# EAGLE schematic AnalogConversion_v3 (EAGLE 9.6.2)

## Sheet 1 of 6: MAIN
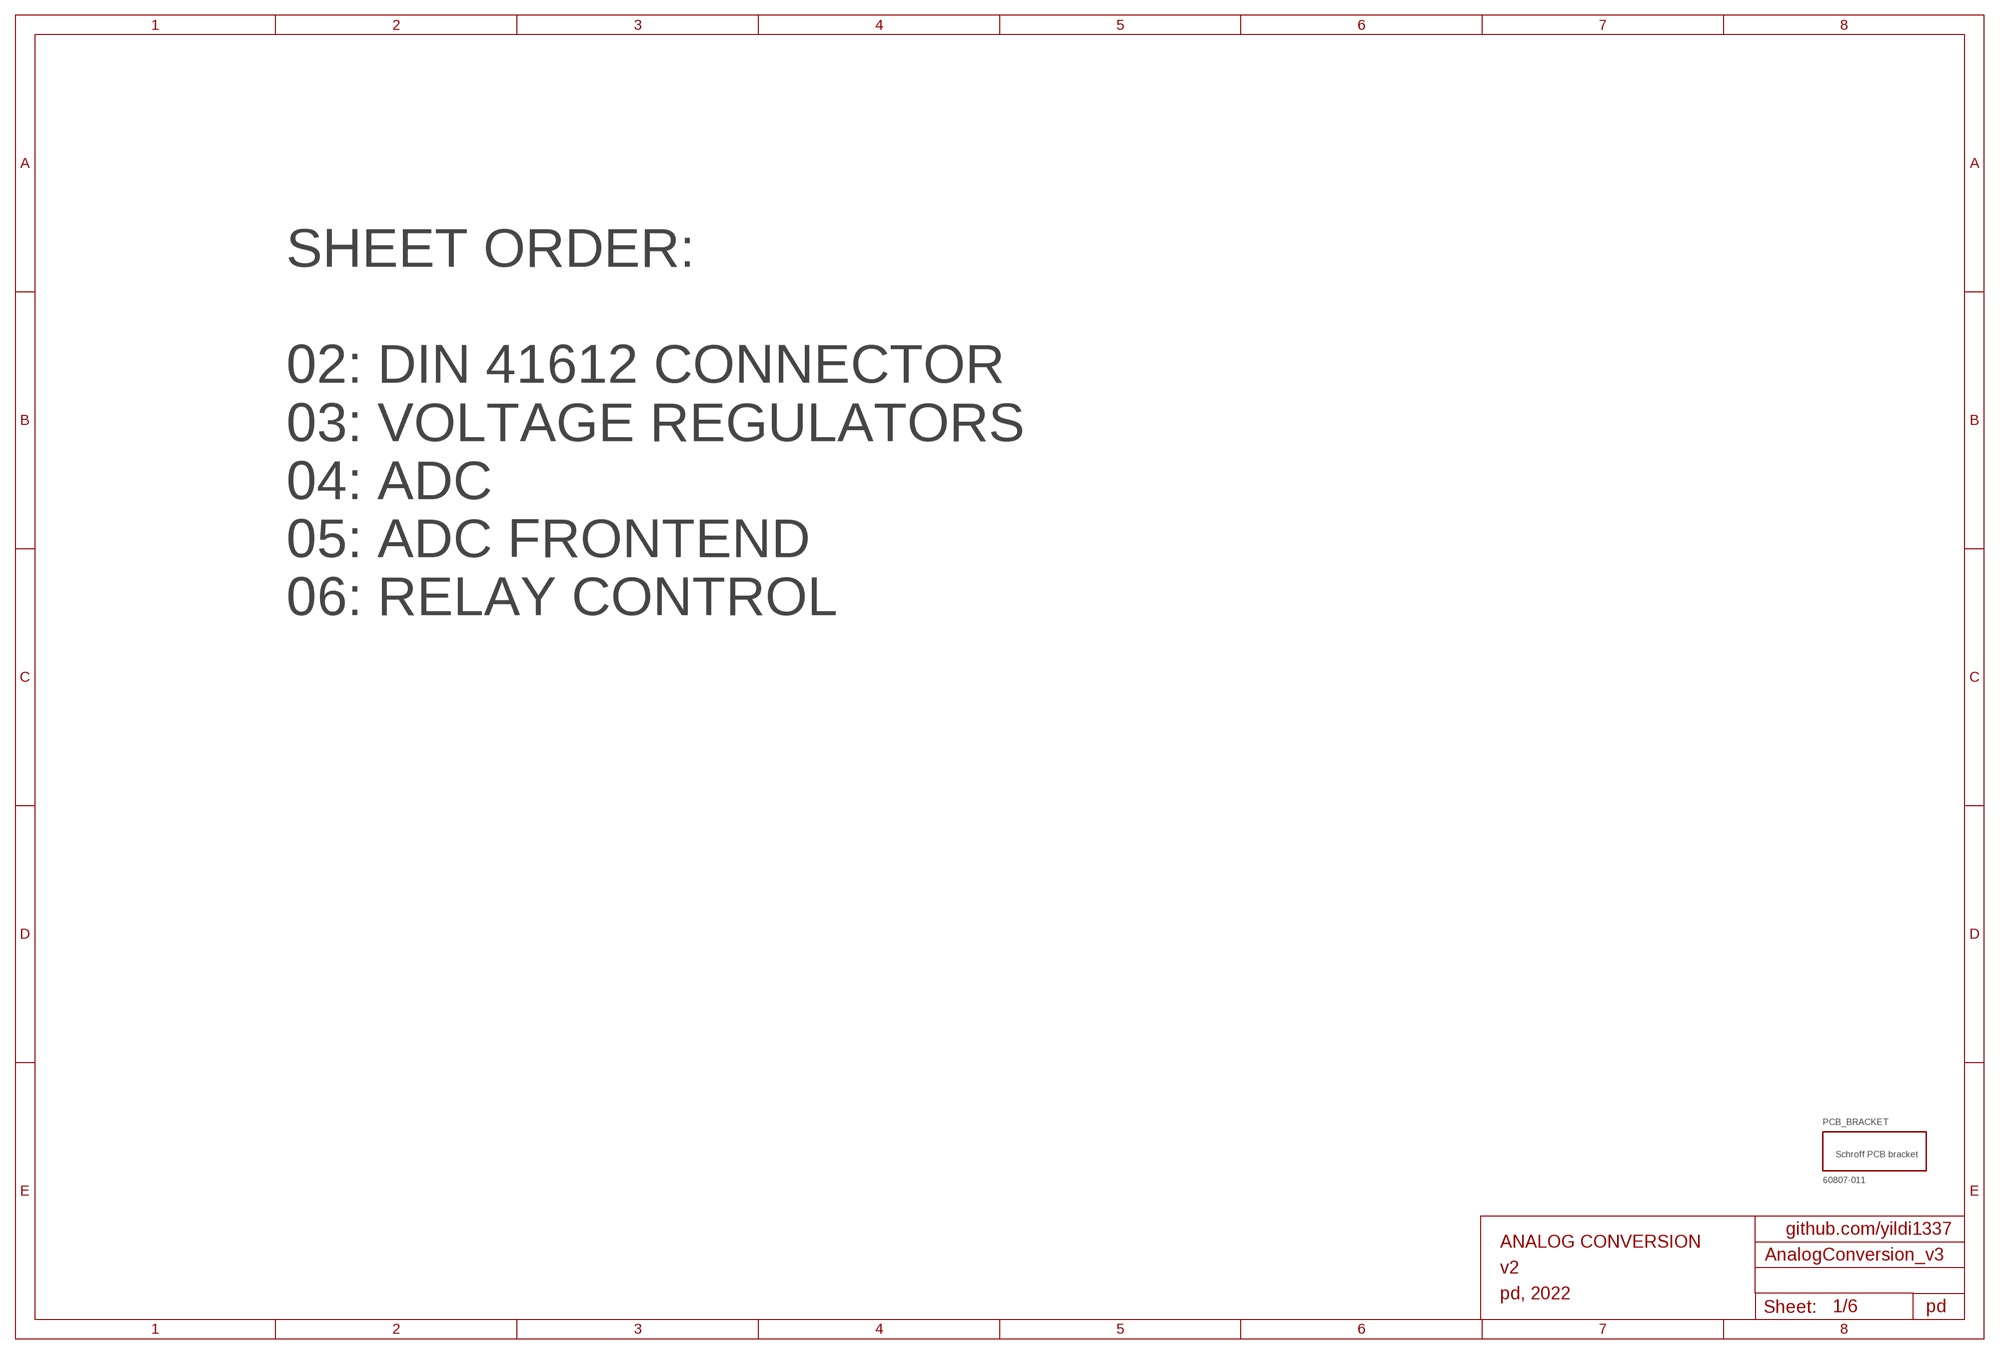
[diagram p0: schematic, sheet 1]

### Parts
PCB_BRACKET  60807-011  [60807-011]

### Notes on the sheet
- SHEET ORDER:
  
  02: DIN 41612 CONNECTOR
  03: VOLTAGE REGULATORS
  04: ADC
  05: ADC FRONTEND
  06: RELAY CONTROL
- github.com/yildi1337
- ANALOG CONVERSION
- v2
- pd, 2022
- pd

## Sheet 2 of 6: DIN 41612 CONNECTOR
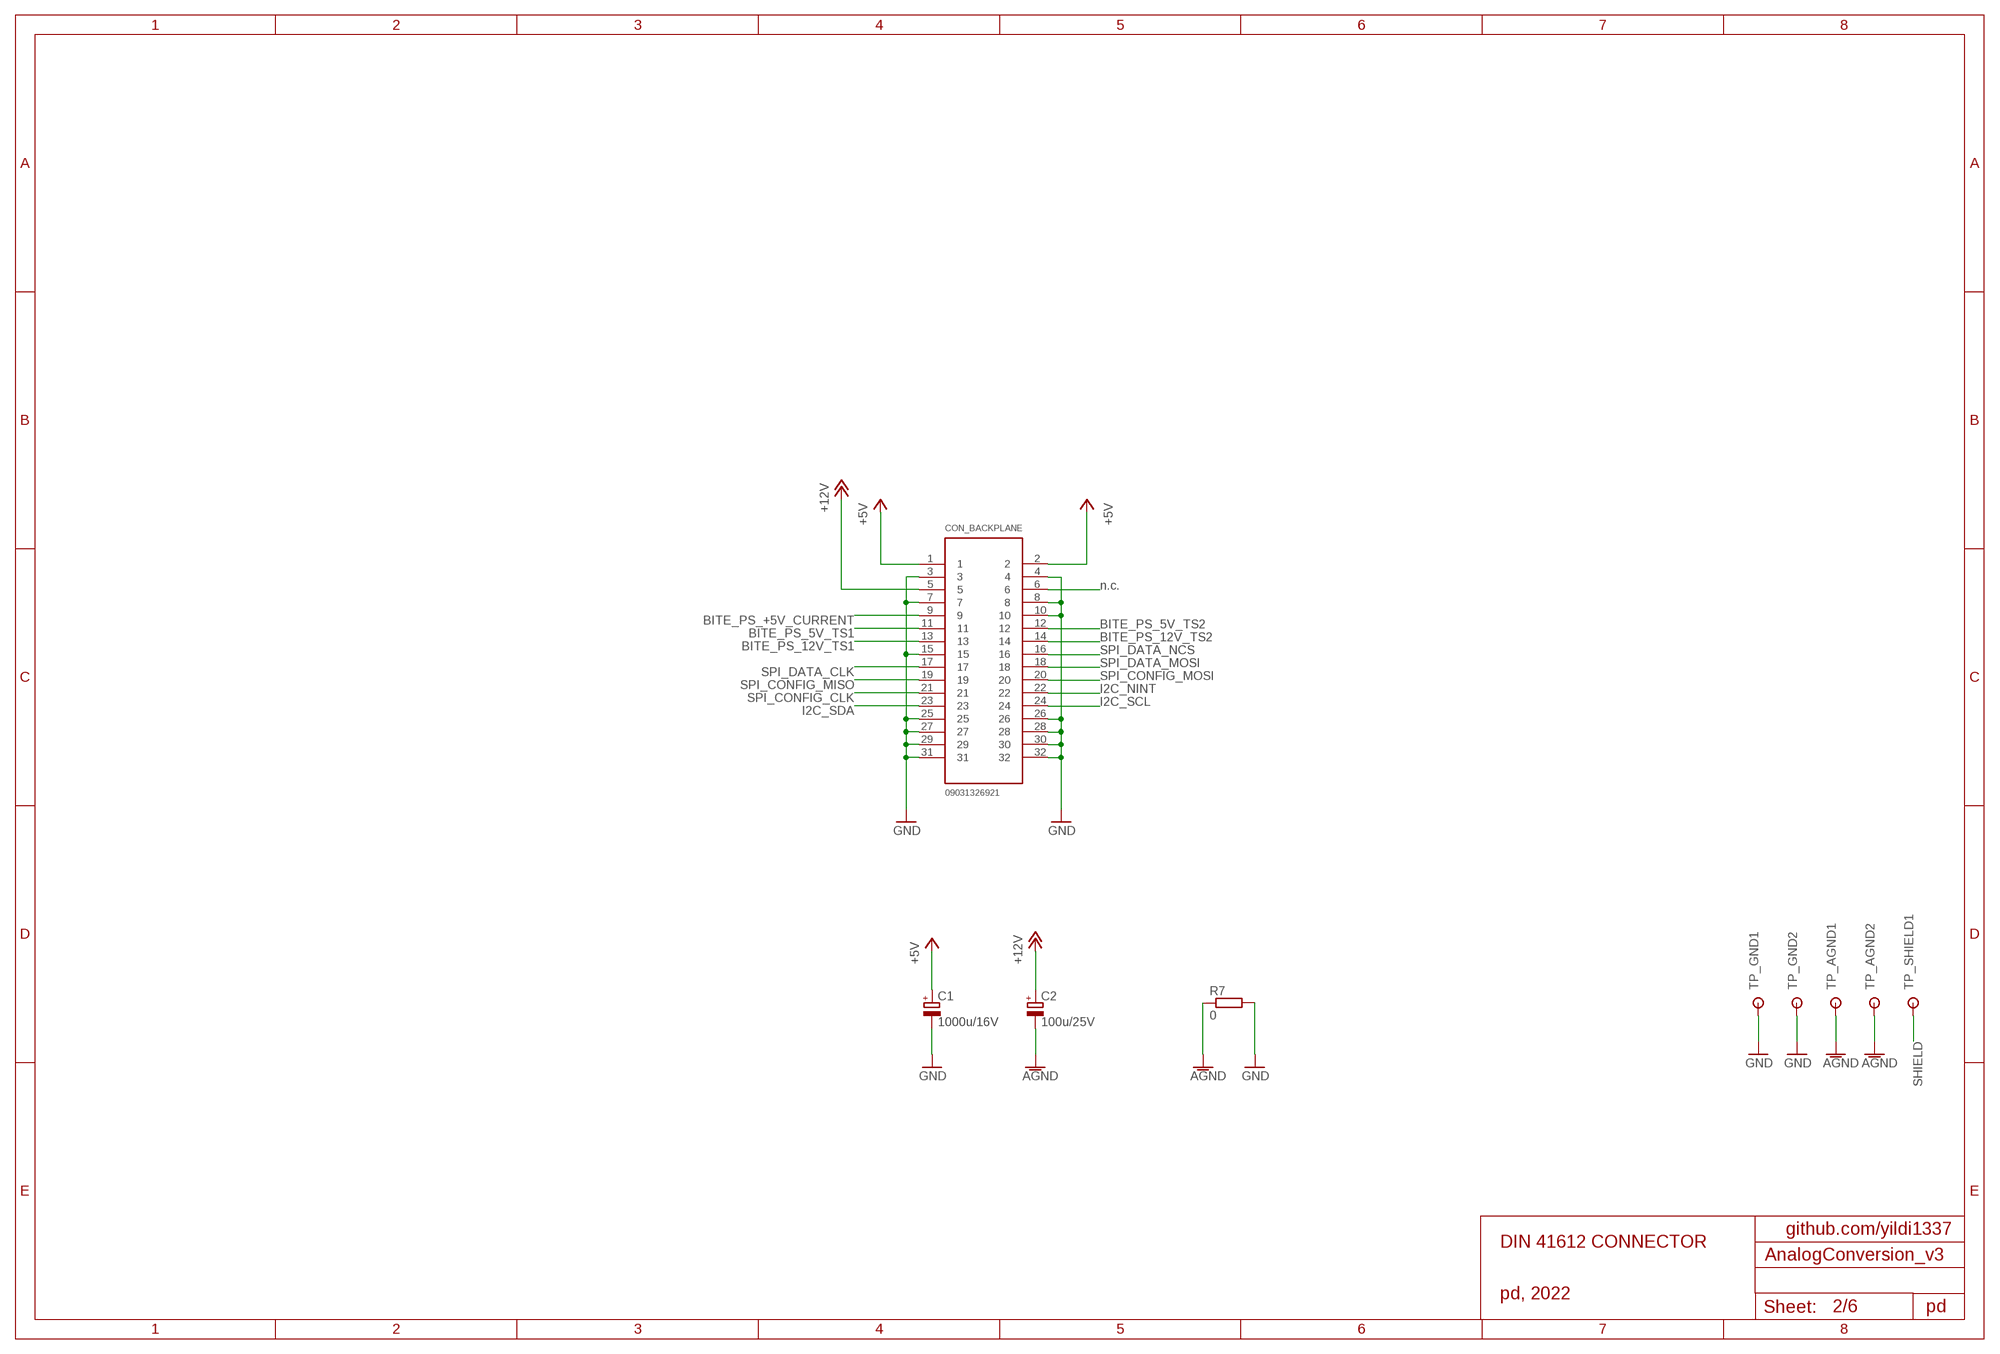
[diagram p1: schematic, sheet 2]

### Parts
C1  1000u/16V  CPOL-EU153CLV-1010  [153CLV-1010]
C2  100u/25V  CPOL-EU153CLV-0810  [153CLV-0810]
CON_BACKPLANE  09031326921  [09031326921]
R7  0  R-EU_R0603  [R0603]
TP_AGND1  RSPRO-1MM-TERMINAL-POST-2622034  [RSPRO-1MM-TERMINAL-POST-2622034]
TP_AGND2  RSPRO-1MM-TERMINAL-POST-2622034  [RSPRO-1MM-TERMINAL-POST-2622034]
TP_GND1  RSPRO-1MM-TERMINAL-POST-2622034  [RSPRO-1MM-TERMINAL-POST-2622034]
TP_GND2  RSPRO-1MM-TERMINAL-POST-2622034  [RSPRO-1MM-TERMINAL-POST-2622034]
TP_SHIELD1  RSPRO-1MM-TERMINAL-POST-2622034  [RSPRO-1MM-TERMINAL-POST-2622034]

### Nets
+5V: C1.+ CON_BACKPLANE.1 CON_BACKPLANE.2 ; also sheet 3,6
+12V: C2.+ CON_BACKPLANE.5 ; also sheet 3
AGND: C2.- R7.1 TP_AGND1.P$1 TP_AGND2.P$1 ; also sheet 3,4,5
BITE_PS_5V_TS1: CON_BACKPLANE.11
BITE_PS_5V_TS2: CON_BACKPLANE.12
BITE_PS_12V_TS1: CON_BACKPLANE.13
BITE_PS_12V_TS2: CON_BACKPLANE.14
BITE_PS_+5V_CURRENT: CON_BACKPLANE.9
GND: C1.- CON_BACKPLANE.3 CON_BACKPLANE.4 CON_BACKPLANE.7 CON_BACKPLANE.8 CON_BACKPLANE.10 CON_BACKPLANE.15 CON_BACKPLANE.25 CON_BACKPLANE.26 CON_BACKPLANE.27 CON_BACKPLANE.28 CON_BACKPLANE.29 CON_BACKPLANE.30 CON_BACKPLANE.31 CON_BACKPLANE.32 R7.2 TP_GND1.P$1 TP_GND2.P$1 ; also sheet 3,4,6
I2C_NINT: CON_BACKPLANE.22 ; also sheet 6
I2C_SCL: CON_BACKPLANE.24 ; also sheet 6
I2C_SDA: CON_BACKPLANE.23 ; also sheet 6
N$2: CON_BACKPLANE.6
SHIELD: TP_SHIELD1.P$1 ; also sheet 5
SPI_CONFIG_CLK: CON_BACKPLANE.21 ; also sheet 4,6
SPI_CONFIG_MISO: CON_BACKPLANE.19 ; also sheet 4,6
SPI_CONFIG_MOSI: CON_BACKPLANE.20 ; also sheet 4,6
SPI_DATA_CLK: CON_BACKPLANE.17 ; also sheet 4
SPI_DATA_MOSI: CON_BACKPLANE.18 ; also sheet 4
SPI_DATA_NCS: CON_BACKPLANE.16 ; also sheet 4

### Notes on the sheet
- n.c.
- github.com/yildi1337
- DIN 41612 CONNECTOR
- pd, 2022
- pd

## Sheet 3 of 6: VOLTAGE REGULATORS
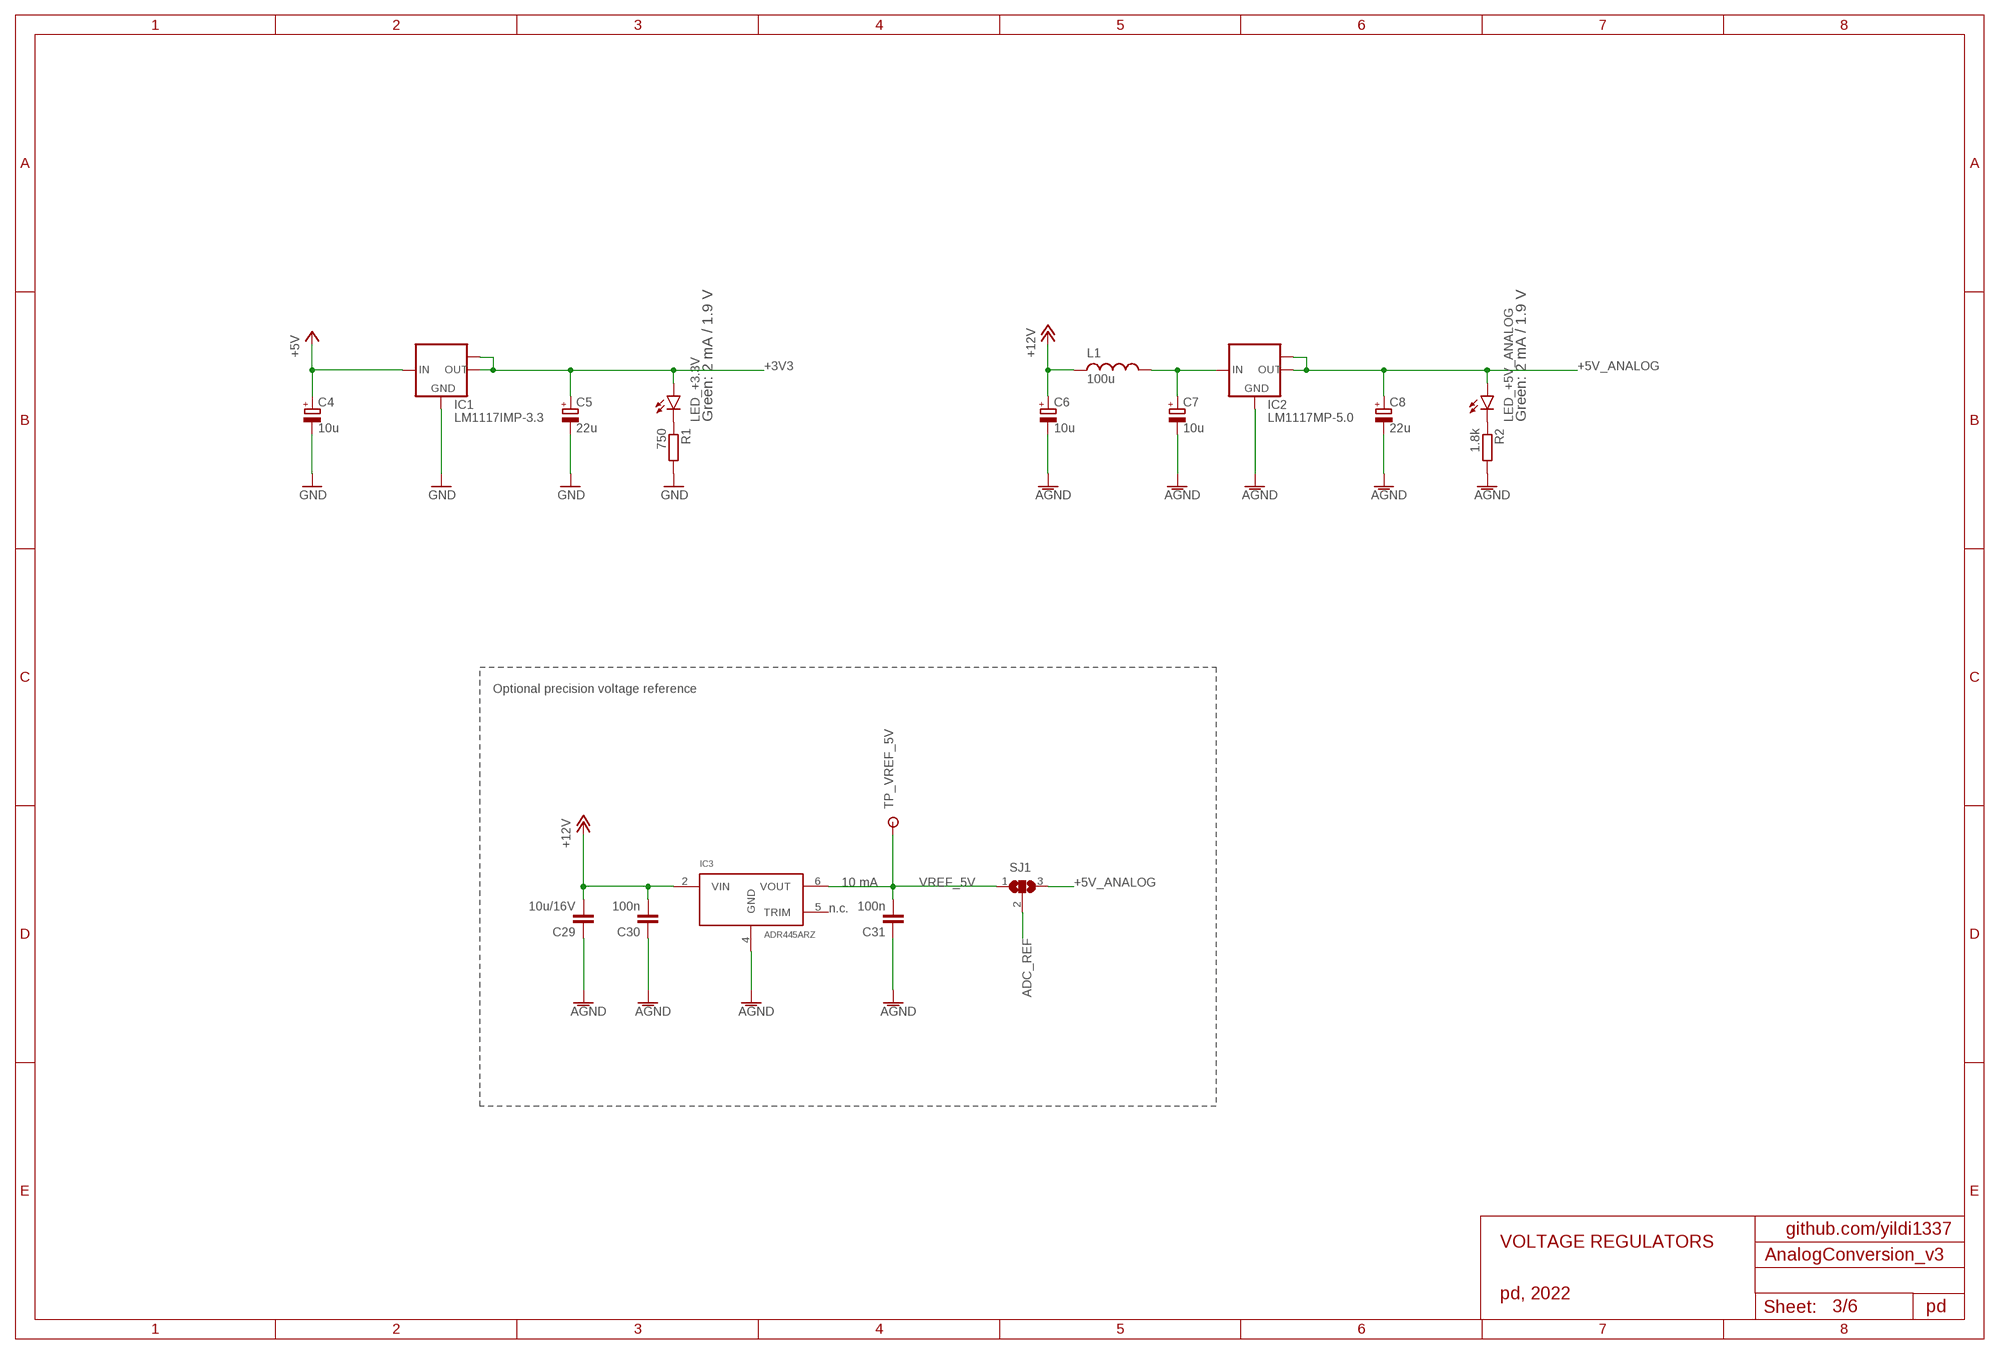
[diagram p2: schematic, sheet 3]

### Parts
C4  10u  CPOL-EUCT3216  [CT3216]
C5  22u  CPOL-EUCT6032  [CT6032]
C6  10u  CPOL-EUCT3216  [CT3216]
C7  10u  CPOL-EUCT3216  [CT3216]
C8  22u  CPOL-EUCT6032  [CT6032]
C29  10u/16V  C-EUC0805  [C0805]
C30  100n  C-EUC0603  [C0603]
C31  100n  C-EUC0603  [C0603]
IC1  LM1117IMP-3.3  LM1117IMPX-3.3  [SOT223]
IC2  LM1117MP-5.0  LM1117MPX-5.0  [SOT223]
IC3  ADR445ARZ  [ADR445ARZ]
L1  100u  VLS6045AF-101M  [VLS6045AF-101M]
LED_+3.3V  LEDCHIP-LED0603  [CHIP-LED0603]
LED_+5V_ANALOG  LEDCHIP-LED0603  [CHIP-LED0603]
R1  750  R-EU_R0603  [R0603]
R2  1.8k  R-EU_R0603  [R0603]
SJ1  SJ2W  [SJ_2]
TP_VREF_5V  RSPRO-1MM-TERMINAL-POST-2622034  [RSPRO-1MM-TERMINAL-POST-2622034]

### Nets
+3V3: C5.+ IC1.2(OUT) IC1.TAB(OUT1) LED_+3.3V.A ; also sheet 4,6
+5V: C4.+ IC1.3(IN) ; also sheet 2,6
+5V_ANALOG: C8.+ IC2.2(OUT) IC2.TAB(OUT1) LED_+5V_ANALOG.A SJ1.3 ; also sheet 4,5
+12V: C6.+ C29.2 C30.2 IC3.2(VIN) L1.1 ; also sheet 2
ADC_REF: SJ1.2 ; also sheet 4
AGND: C6.- C7.- C8.- C29.1 C30.1 C31.1 IC2.1(GND) IC3.4(GND) R2.2 ; also sheet 2,4,5
GND: C4.- C5.- IC1.1(GND) R1.2 ; also sheet 2,4,6
N$4: C7.+ IC2.3(IN) L1.2
N$49: LED_+3.3V.C R1.1
N$50: LED_+5V_ANALOG.C R2.1
VREF_5V: C31.2 IC3.6(VOUT) SJ1.1 TP_VREF_5V.P$1
Unconnected: IC3.5(TRIM)

### Notes on the sheet
- Green: 2 mA / 1.9 V | Green: 2 mA / 1.9 V
- Optional precision voltage reference
- 10 mA
- n.c.
- github.com/yildi1337
- VOLTAGE REGULATORS
- pd, 2022
- pd

## Sheet 4 of 6: ADC
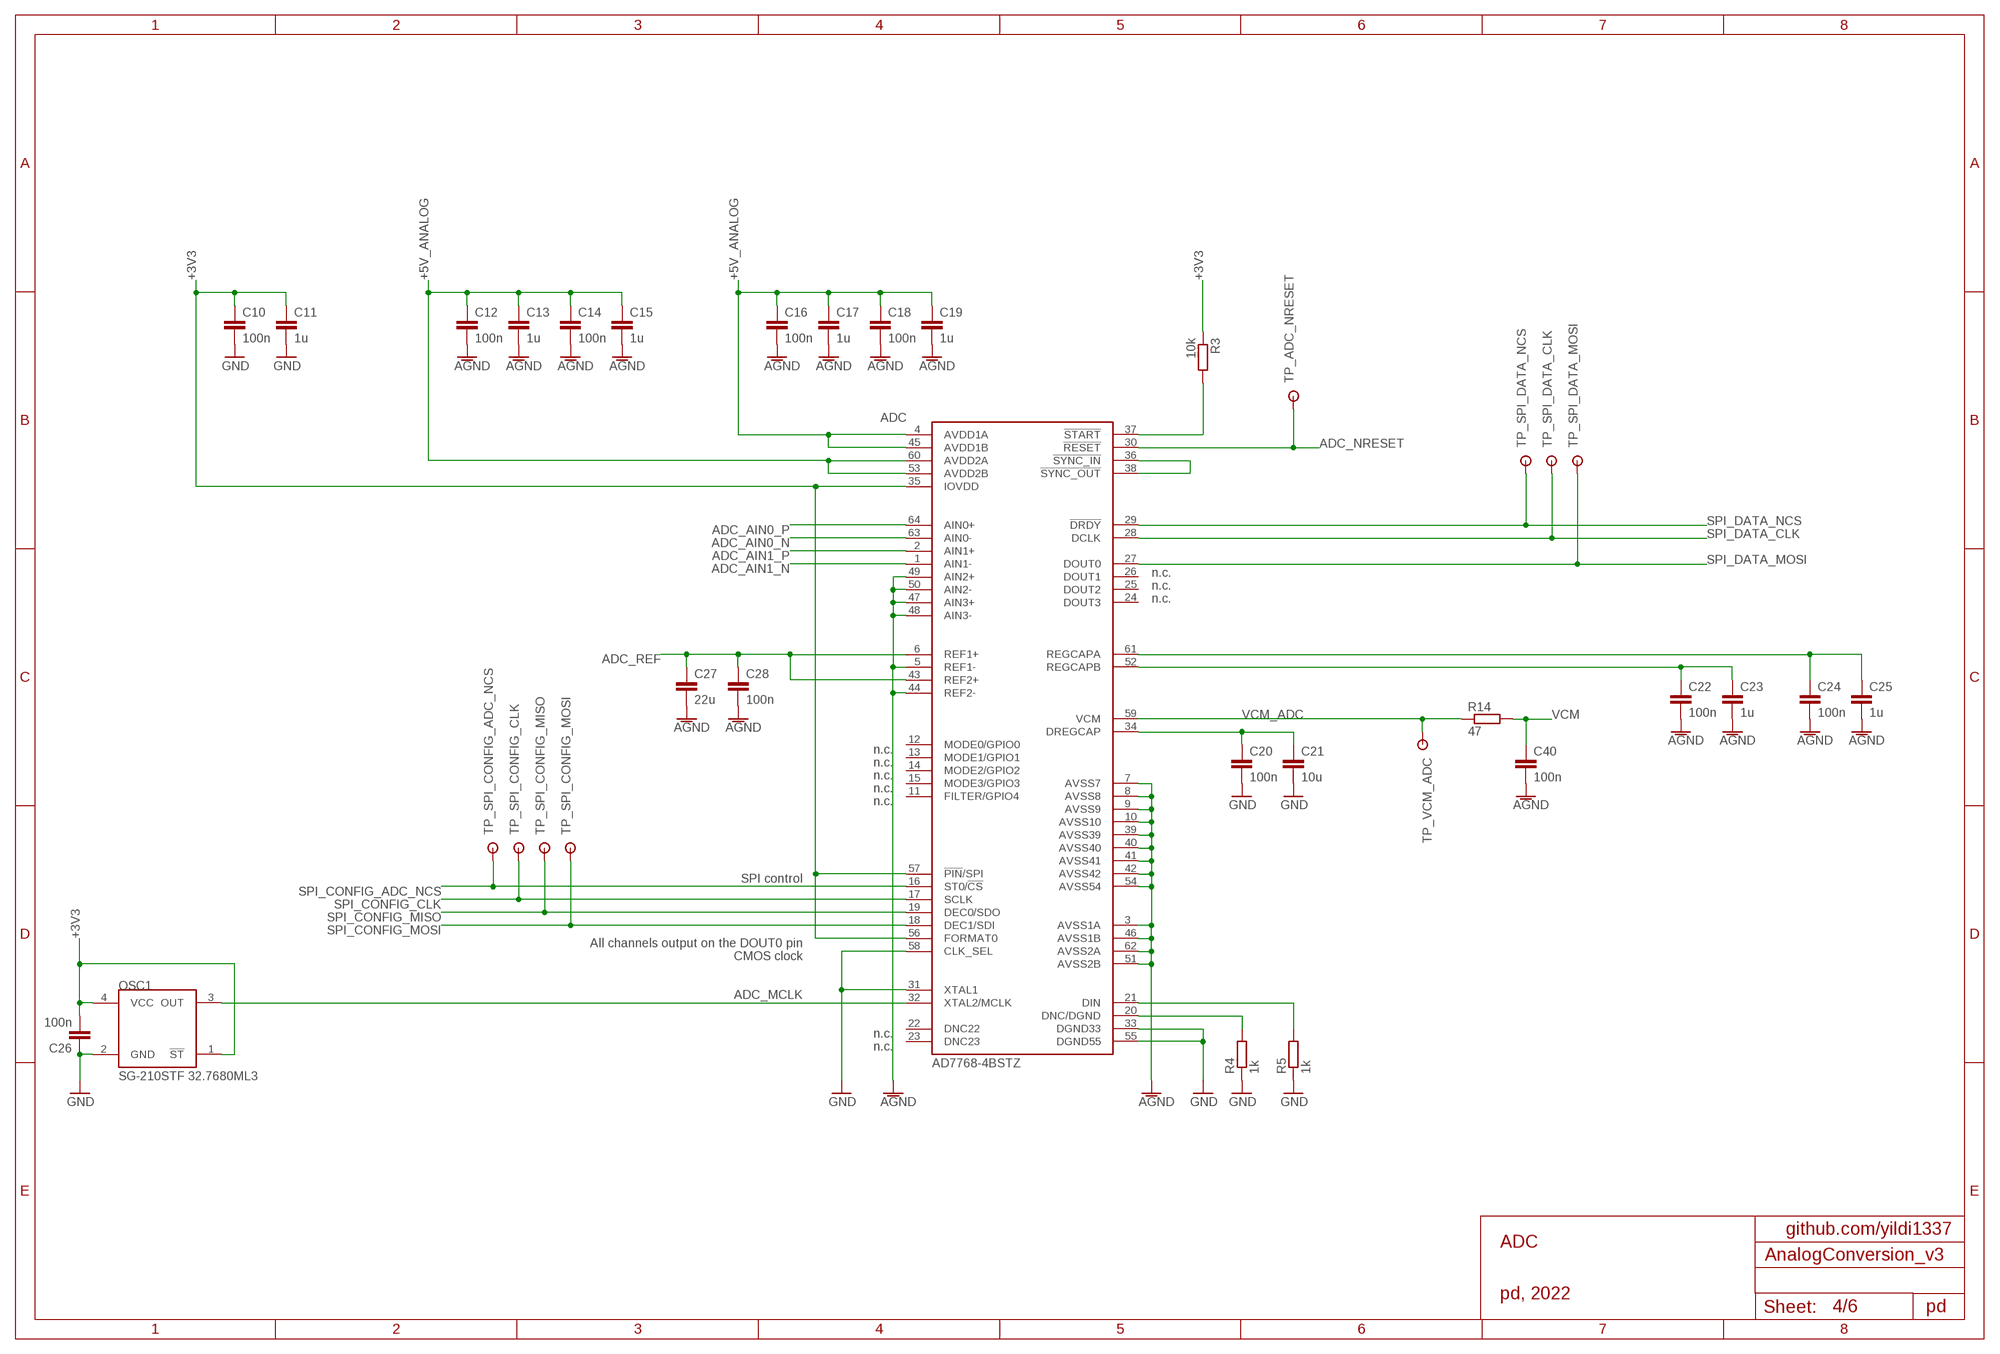
[diagram p3: schematic, sheet 4]

### Parts
ADC  AD7768-4BSTZ  [AD7768-4BSTZ]
C10  100n  C-EUC0603  [C0603]
C11  1u  C-EUC0603  [C0603]
C12  100n  C-EUC0603  [C0603]
C13  1u  C-EUC0603  [C0603]
C14  100n  C-EUC0603  [C0603]
C15  1u  C-EUC0603  [C0603]
C16  100n  C-EUC0603  [C0603]
C17  1u  C-EUC0603  [C0603]
C18  100n  C-EUC0603  [C0603]
C19  1u  C-EUC0603  [C0603]
C20  100n  C-EUC0603  [C0603]
C21  10u  C-EUC0603  [C0603]
C22  100n  C-EUC0603  [C0603]
C23  1u  C-EUC0603  [C0603]
C24  100n  C-EUC0603  [C0603]
C25  1u  C-EUC0603  [C0603]
C26  100n  C-EUC0603  [C0603]
C27  22u  C-EUC1206  [C1206]
C28  100n  C-EUC0603  [C0603]
C40  100n  C-EUC0603  [C0603]
OSC1  SG-210STF 32.7680ML3  SG-210STF-32.7680ML3  [SG-210STF-32.7680ML3]
R3  10k  R-EU_R0603  [R0603]
R4  1k  R-EU_R0603  [R0603]
R5  1k  R-EU_R0603  [R0603]
R14  47  R-EU_R0603  [R0603]
TP_ADC_NRESET  RSPRO-1MM-TERMINAL-POST-2622034  [RSPRO-1MM-TERMINAL-POST-2622034]
TP_SPI_CONFIG_ADC_NCS  RSPRO-1MM-TERMINAL-POST-2622034  [RSPRO-1MM-TERMINAL-POST-2622034]
TP_SPI_CONFIG_CLK  RSPRO-1MM-TERMINAL-POST-2622034  [RSPRO-1MM-TERMINAL-POST-2622034]
TP_SPI_CONFIG_MISO  RSPRO-1MM-TERMINAL-POST-2622034  [RSPRO-1MM-TERMINAL-POST-2622034]
TP_SPI_CONFIG_MOSI  RSPRO-1MM-TERMINAL-POST-2622034  [RSPRO-1MM-TERMINAL-POST-2622034]
TP_SPI_DATA_CLK  RSPRO-1MM-TERMINAL-POST-2622034  [RSPRO-1MM-TERMINAL-POST-2622034]
TP_SPI_DATA_MOSI  RSPRO-1MM-TERMINAL-POST-2622034  [RSPRO-1MM-TERMINAL-POST-2622034]
TP_SPI_DATA_NCS  RSPRO-1MM-TERMINAL-POST-2622034  [RSPRO-1MM-TERMINAL-POST-2622034]
TP_VCM_ADC  RSPRO-1MM-TERMINAL-POST-2622034  [RSPRO-1MM-TERMINAL-POST-2622034]

### Nets
+3V3: ADC.35(IOVDD) ADC.56(FORMAT0) ADC.57(!PIN!/SPI) C10.1 C11.1 C26.2 OSC1.1(!ST) OSC1.4(VCC) R3.1 ; also sheet 3,6
+5V_ANALOG: ADC.4(AVDD1A) ADC.45(AVDD1B) ADC.53(AVDD2B) ADC.60(AVDD2A) C12.1 C13.1 C14.1 C15.1 C16.1 C17.1 C18.1 C19.1 ; also sheet 3,5
ADC_AIN0_N: ADC.63(AIN0-) ; also sheet 5
ADC_AIN0_P: ADC.64(AIN0+) ; also sheet 5
ADC_AIN1_N: ADC.1(AIN1-) ; also sheet 5
ADC_AIN1_P: ADC.2(AIN1+) ; also sheet 5
ADC_MCLK: ADC.32(XTAL2/MCLK) OSC1.3(OUT)
ADC_NRESET: ADC.30(!RESET!) TP_ADC_NRESET.P$1 ; also sheet 6
ADC_REF: ADC.6(REF1+) ADC.43(REF2+) C27.1 C28.1 ; also sheet 3
AGND: ADC.3(AVSS1A) ADC.5(REF1-) ADC.7(AVSS7) ADC.8(AVSS8) ADC.9(AVSS9) ADC.10(AVSS10) ADC.39(AVSS39) ADC.40(AVSS40) ADC.41(AVSS41) ADC.42(AVSS42) ADC.44(REF2-) ADC.46(AVSS1B) ADC.47(AIN3+) ADC.48(AIN3-) ADC.49(AIN2+) ADC.50(AIN2-) ADC.51(AVSS2B) ADC.54(AVSS54) ADC.62(AVSS2A) C12.2 C13.2 C14.2 C15.2 C16.2 C17.2 C18.2 C19.2 C22.2 C23.2 C24.2 C25.2 C27.2 C28.2 C40.2 ; also sheet 2,3,5
DIN: ADC.21(DIN) R5.2
DNC/DGND: ADC.20(DNC/DGND) R4.2
DREGCAP: ADC.34(DREGCAP) C20.1 C21.1
GND: ADC.31(XTAL1) ADC.33(DGND33) ADC.55(DGND55) ADC.58(CLK_SEL) C10.2 C11.2 C20.2 C21.2 C26.1 OSC1.2(GND) R4.1 R5.1 ; also sheet 2,3,6
N$78: ADC.36(!SYNC_IN!) ADC.38(!SYNC_OUT!)
N$81: ADC.37(!START!) R3.2
REGCAPA: ADC.61(REGCAPA) C24.1 C25.1
REGCAPB: ADC.52(REGCAPB) C22.1 C23.1
SPI_CONFIG_ADC_NCS: ADC.16(ST0/!CS!) TP_SPI_CONFIG_ADC_NCS.P$1 ; also sheet 6
SPI_CONFIG_CLK: ADC.17(SCLK) TP_SPI_CONFIG_CLK.P$1 ; also sheet 2,6
SPI_CONFIG_MISO: ADC.19(DEC0/SDO) TP_SPI_CONFIG_MISO.P$1 ; also sheet 2,6
SPI_CONFIG_MOSI: ADC.18(DEC1/SDI) TP_SPI_CONFIG_MOSI.P$1 ; also sheet 2,6
SPI_DATA_CLK: ADC.28(DCLK) TP_SPI_DATA_CLK.P$1 ; also sheet 2
SPI_DATA_MOSI: ADC.27(DOUT0) TP_SPI_DATA_MOSI.P$1 ; also sheet 2
SPI_DATA_NCS: ADC.29(!DRDY!) TP_SPI_DATA_NCS.P$1 ; also sheet 2
VCM: C40.1 R14.2 ; also sheet 5
VCM_ADC: ADC.59(VCM) R14.1 TP_VCM_ADC.P$1
Unconnected: ADC.11(FILTER/GPIO4) ADC.12(MODE0/GPIO0) ADC.13(MODE1/GPIO1) ADC.14(MODE2/GPIO2) ADC.15(MODE3/GPIO3) ADC.22(DNC22) ADC.23(DNC23) ADC.24(DOUT3) ADC.25(DOUT2) ADC.26(DOUT1)

### Notes on the sheet
- n.c.
- n.c.
- n.c.
- n.c.
- n.c.
- n.c.
- n.c.
- n.c.
- SPI control
- All channels output on the DOUT0 pin
- CMOS clock
- n.c.
- n.c.
- github.com/yildi1337
- ADC
- pd, 2022
- pd

## Sheet 5 of 6: ADC FRONTEND
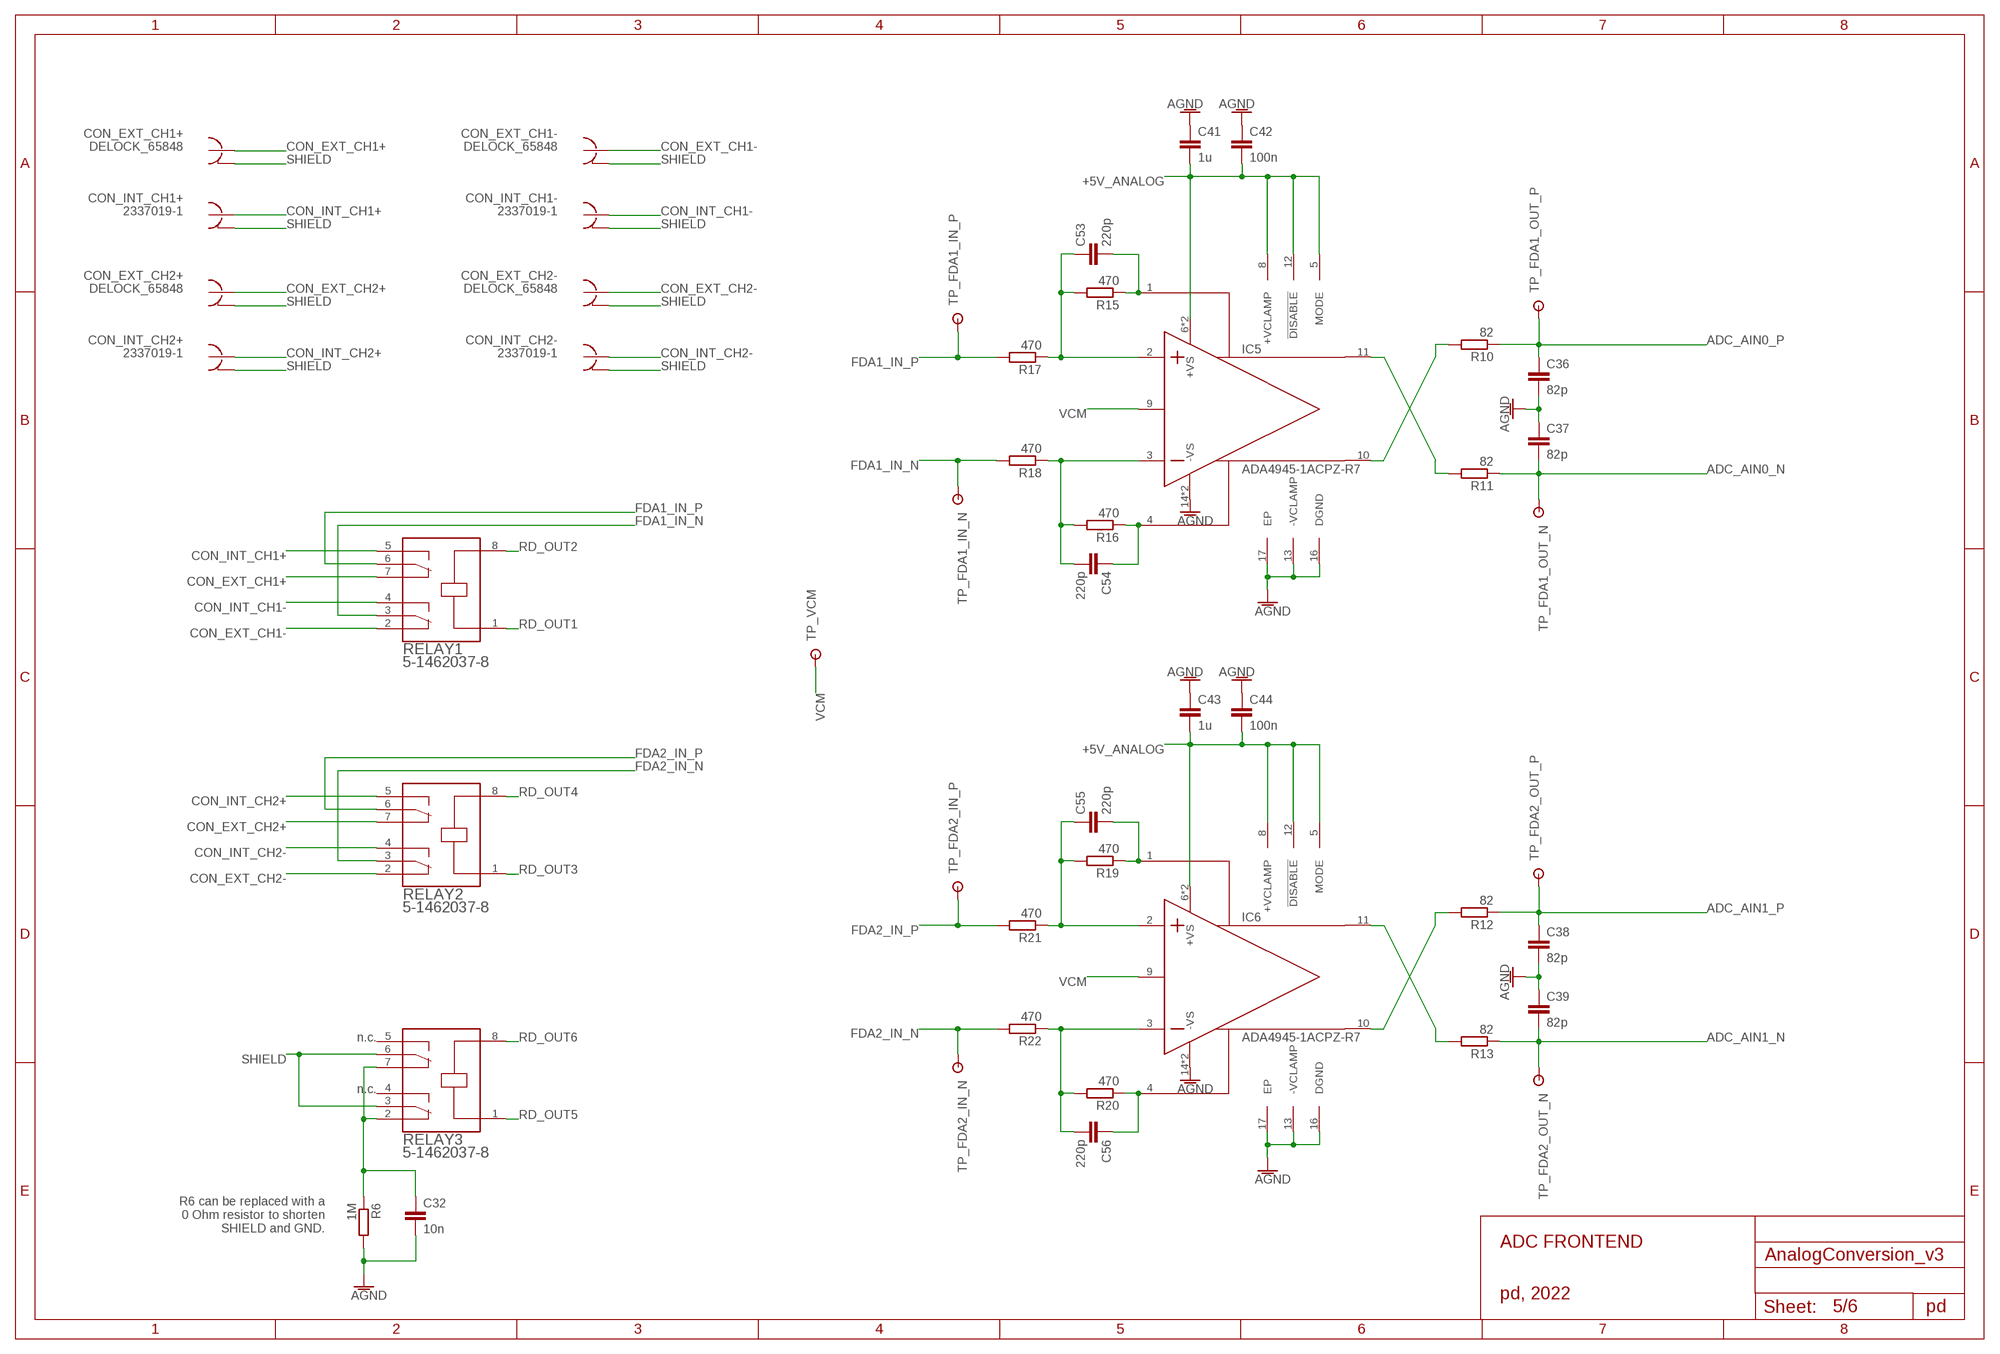
[diagram p4: schematic, sheet 5]

### Parts
C32  10n  C-EUC0603  [C0603]
C36  82p  C-EUC0603  [C0603]
C37  82p  C-EUC0603  [C0603]
C38  82p  C-EUC0603  [C0603]
C39  82p  C-EUC0603  [C0603]
C41  1u  C-EUC0603  [C0603]
C42  100n  C-EUC0603  [C0603]
C43  1u  C-EUC0603  [C0603]
C44  100n  C-EUC0603  [C0603]
C53  220p  C-EUC0603  [C0603]
C54  220p  C-EUC0603  [C0603]
C55  220p  C-EUC0603  [C0603]
C56  220p  C-EUC0603  [C0603]
CON_EXT_CH1+  DELOCK_65848  [DELOCK_65848]
CON_EXT_CH1-  DELOCK_65848  [DELOCK_65848]
CON_EXT_CH2+  DELOCK_65848  [DELOCK_65848]
CON_EXT_CH2-  DELOCK_65848  [DELOCK_65848]
CON_INT_CH1+  2337019-1  [2337019-1]
CON_INT_CH1-  2337019-1  [2337019-1]
CON_INT_CH2+  2337019-1  [2337019-1]
CON_INT_CH2-  2337019-1  [2337019-1]
IC5  ADA4945-1ACPZ-R7  [ADA4945-1ACPZ-R7]
IC6  ADA4945-1ACPZ-R7  [ADA4945-1ACPZ-R7]
R6  1M  R-EU_R0603  [R0603]
R10  82  R-EU_R0603  [R0603]
R11  82  R-EU_R0603  [R0603]
R12  82  R-EU_R0603  [R0603]
R13  82  R-EU_R0603  [R0603]
R15  470  R-EU_R0603  [R0603]
R16  470  R-EU_R0603  [R0603]
R17  470  R-EU_R0603  [R0603]
R18  470  R-EU_R0603  [R0603]
R19  470  R-EU_R0603  [R0603]
R20  470  R-EU_R0603  [R0603]
R21  470  R-EU_R0603  [R0603]
R22  470  R-EU_R0603  [R0603]
RELAY1  5-1462037-8  [5-1462037-8]
RELAY2  5-1462037-8  [5-1462037-8]
RELAY3  5-1462037-8  [5-1462037-8]
TP_FDA1_IN_N  RSPRO-1MM-TERMINAL-POST-2622034  [RSPRO-1MM-TERMINAL-POST-2622034]
TP_FDA1_IN_P  RSPRO-1MM-TERMINAL-POST-2622034  [RSPRO-1MM-TERMINAL-POST-2622034]
TP_FDA1_OUT_N  RSPRO-1MM-TERMINAL-POST-2622034  [RSPRO-1MM-TERMINAL-POST-2622034]
TP_FDA1_OUT_P  RSPRO-1MM-TERMINAL-POST-2622034  [RSPRO-1MM-TERMINAL-POST-2622034]
TP_FDA2_IN_N  RSPRO-1MM-TERMINAL-POST-2622034  [RSPRO-1MM-TERMINAL-POST-2622034]
TP_FDA2_IN_P  RSPRO-1MM-TERMINAL-POST-2622034  [RSPRO-1MM-TERMINAL-POST-2622034]
TP_FDA2_OUT_N  RSPRO-1MM-TERMINAL-POST-2622034  [RSPRO-1MM-TERMINAL-POST-2622034]
TP_FDA2_OUT_P  RSPRO-1MM-TERMINAL-POST-2622034  [RSPRO-1MM-TERMINAL-POST-2622034]
TP_VCM  RSPRO-1MM-TERMINAL-POST-2622034  [RSPRO-1MM-TERMINAL-POST-2622034]

### Nets
+5V_ANALOG: C41.2 C42.2 C43.2 C44.2 IC5.5(MODE) IC5.6(+VS) IC5.7(+VS) IC5.8(+VCLAMP) IC5.12(!DISABLE) IC6.5(MODE) IC6.6(+VS) IC6.7(+VS) IC6.8(+VCLAMP) IC6.12(!DISABLE) ; also sheet 3,4
ADC_AIN0_N: C37.2 R11.1 TP_FDA1_OUT_N.P$1 ; also sheet 4
ADC_AIN0_P: C36.1 R10.1 TP_FDA1_OUT_P.P$1 ; also sheet 4
ADC_AIN1_N: C39.2 R13.1 TP_FDA2_OUT_N.P$1 ; also sheet 4
ADC_AIN1_P: C38.1 R12.1 TP_FDA2_OUT_P.P$1 ; also sheet 4
AGND: C32.2 C36.2 C37.1 C38.2 C39.1 C41.1 C42.1 C43.1 C44.1 IC5.13(-VCLAMP) IC5.14(-VS) IC5.15(-VS) IC5.16(DGND) IC5.17(EP) IC6.13(-VCLAMP) IC6.14(-VS) IC6.15(-VS) IC6.16(DGND) IC6.17(EP) R6.2 ; also sheet 2,3,4
CON_EXT_CH1+: CON_EXT_CH1+.S RELAY1.7
CON_EXT_CH1-: CON_EXT_CH1-.S RELAY1.2
CON_EXT_CH2+: CON_EXT_CH2+.S RELAY2.7
CON_EXT_CH2-: CON_EXT_CH2-.S RELAY2.2
CON_INT_CH1+: CON_INT_CH1+.S(SIG) RELAY1.5
CON_INT_CH1-: CON_INT_CH1-.S(SIG) RELAY1.4
CON_INT_CH2+: CON_INT_CH2+.S(SIG) RELAY2.5
CON_INT_CH2-: CON_INT_CH2-.S(SIG) RELAY2.4
FDA1_IN_N [DIFF_INPUT_SIGNALS]: R18.2 RELAY1.3 TP_FDA1_IN_N.P$1
FDA1_IN_P [DIFF_INPUT_SIGNALS]: R17.2 RELAY1.6 TP_FDA1_IN_P.P$1
FDA2_IN_N [DIFF_INPUT_SIGNALS]: R22.2 RELAY2.3 TP_FDA2_IN_N.P$1
FDA2_IN_P [DIFF_INPUT_SIGNALS]: R21.2 RELAY2.6 TP_FDA2_IN_P.P$1
N$1: C32.1 R6.1 RELAY3.2 RELAY3.7
N$8: IC6.10(+OUT) R12.2
N$9: IC5.10(+OUT) R10.2
N$10: IC5.11(-OUT) R11.2
N$14: IC6.11(-OUT) R13.2
N$16: C53.1 IC5.2(+IN) R15.2 R17.1
N$17: C53.2 IC5.1(-FB) R15.1
N$18: C54.1 IC5.4(+FB) R16.1
N$19: C54.2 IC5.3(-IN) R16.2 R18.1
N$21: C55.1 IC6.2(+IN) R19.2 R21.1
N$22: C55.2 IC6.1(-FB) R19.1
N$24: C56.2 IC6.3(-IN) R20.2 R22.1
N$25: C56.1 IC6.4(+FB) R20.1
RD_OUT1: RELAY1.1 ; also sheet 6
RD_OUT2: RELAY1.8 ; also sheet 6
RD_OUT3: RELAY2.1 ; also sheet 6
RD_OUT4: RELAY2.8 ; also sheet 6
RD_OUT5: RELAY3.1 ; also sheet 6
RD_OUT6: RELAY3.8 ; also sheet 6
SHIELD: CON_EXT_CH1+.G1(G) CON_EXT_CH1+.G2(G) CON_EXT_CH1+.G3(G) CON_EXT_CH1+.G4(G) CON_EXT_CH1-.G1(G) CON_EXT_CH1-.G2(G) CON_EXT_CH1-.G3(G) CON_EXT_CH1-.G4(G) CON_EXT_CH2+.G1(G) CON_EXT_CH2+.G2(G) CON_EXT_CH2+.G3(G) CON_EXT_CH2+.G4(G) CON_EXT_CH2-.G1(G) CON_EXT_CH2-.G2(G) CON_EXT_CH2-.G3(G) CON_EXT_CH2-.G4(G) CON_INT_CH1+.G1(GND) CON_INT_CH1+.G2(GND) CON_INT_CH1-.G1(GND) CON_INT_CH1-.G2(GND) CON_INT_CH2+.G1(GND) CON_INT_CH2+.G2(GND) CON_INT_CH2-.G1(GND) CON_INT_CH2-.G2(GND) RELAY3.3 RELAY3.6 ; also sheet 2
VCM: IC5.9(VOCM) IC6.9(VOCM) TP_VCM.P$1 ; also sheet 4
Unconnected: RELAY3.4 RELAY3.5

### Notes on the sheet
- n.c.
- n.c.
- R6 can be replaced with a
  0 Ohm resistor to shorten
  SHIELD and GND.
- ADC FRONTEND
- pd, 2022
- pd

## Sheet 6 of 6: RELAY CONTROL
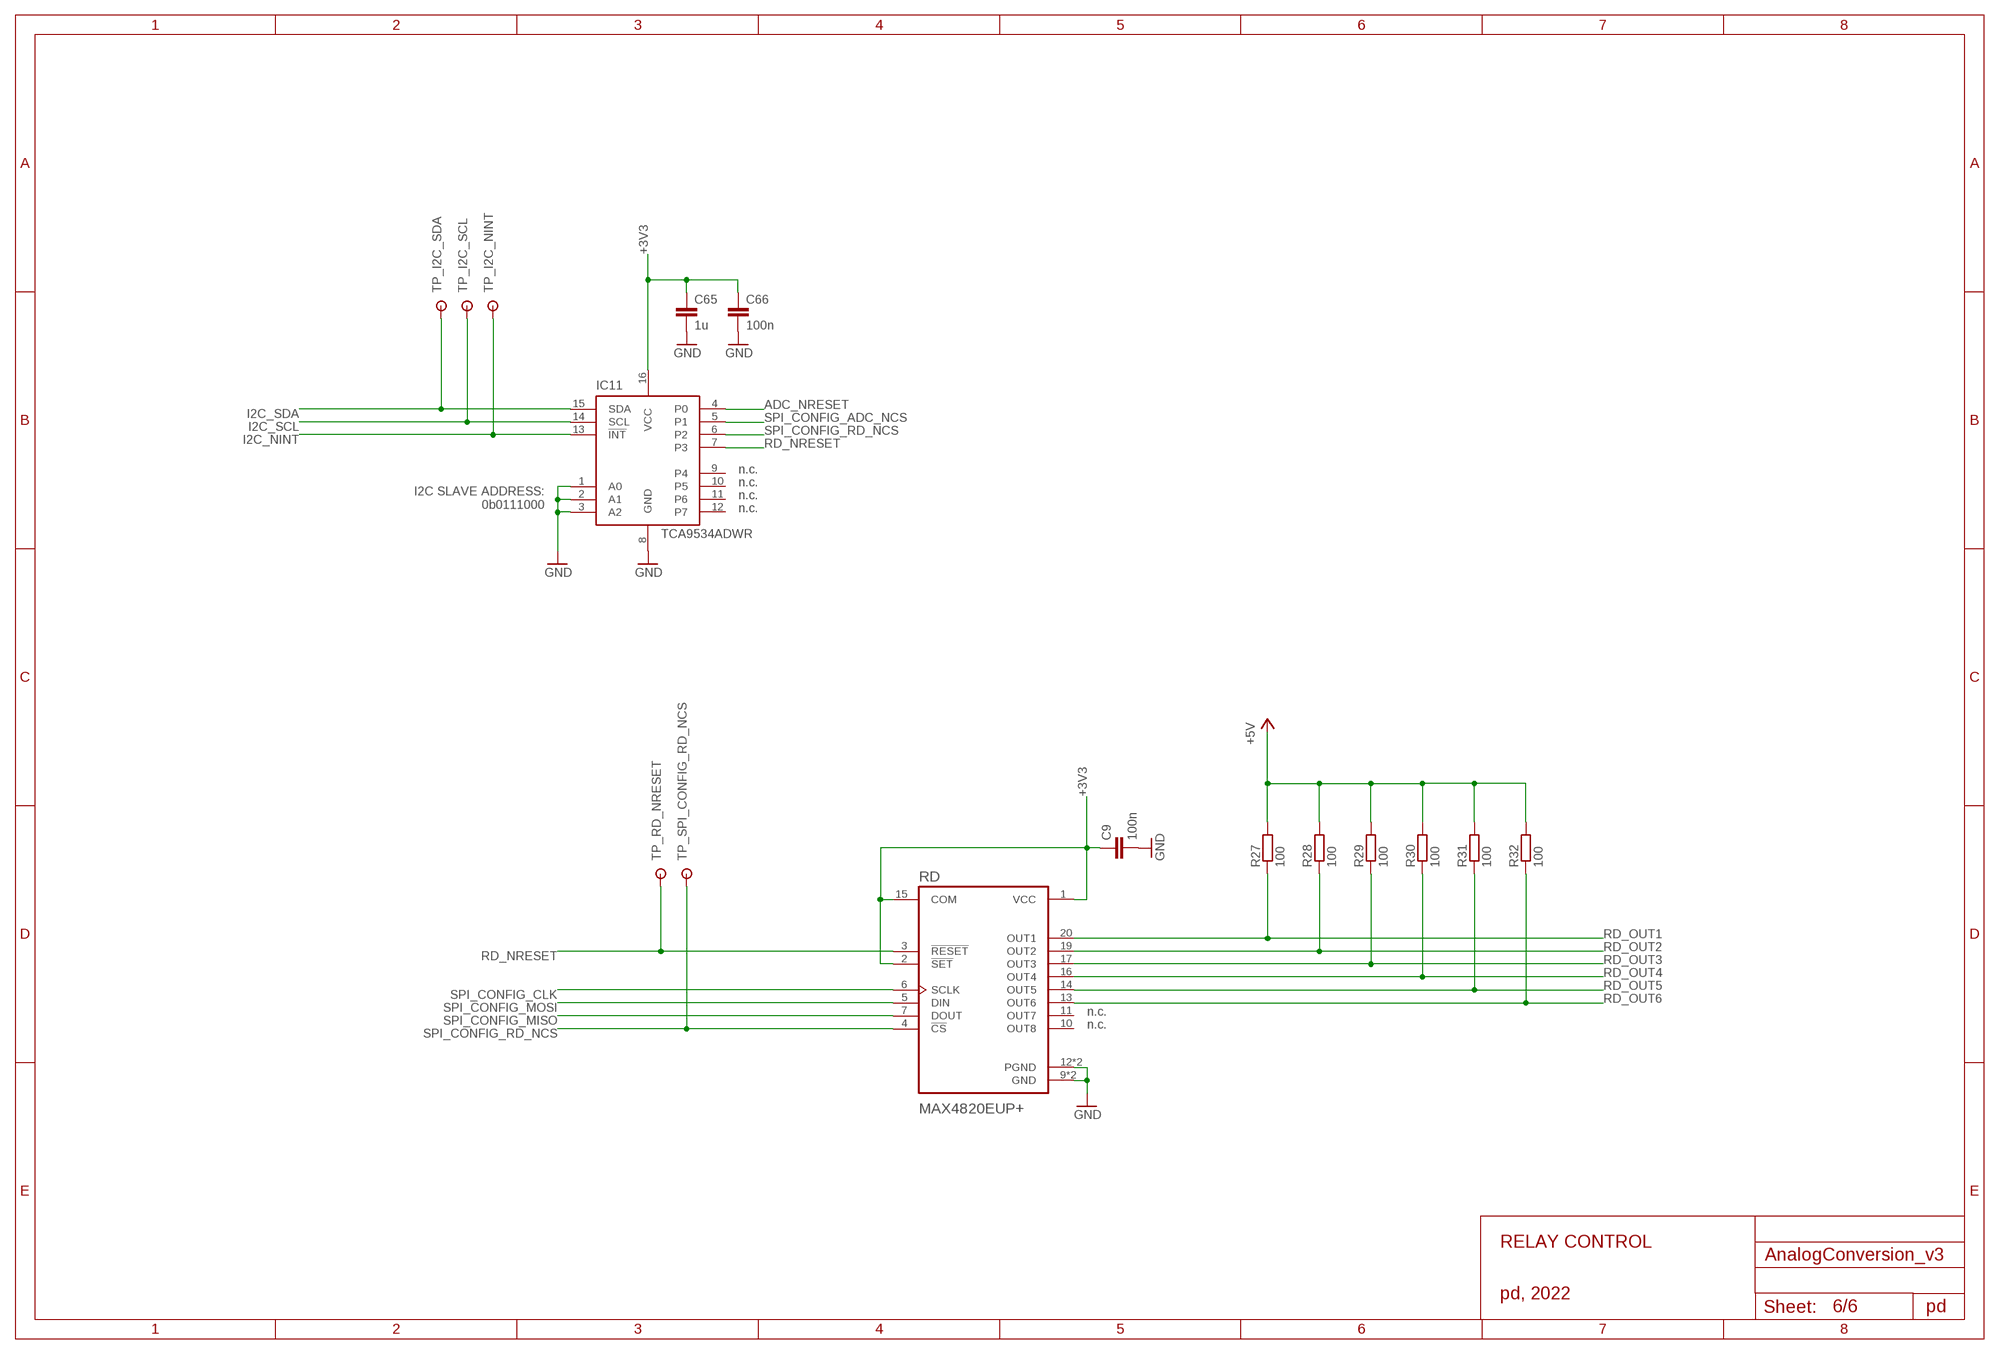
[diagram p5: schematic, sheet 6]

### Parts
C9  100n  C-EUC0603  [C0603]
C65  1u  C-EUC0603  [C0603]
C66  100n  C-EUC0603  [C0603]
IC11  TCA9534ADWR  [TCA9534ADWR]
R27  100  R-EU_R0603  [R0603]
R28  100  R-EU_R0603  [R0603]
R29  100  R-EU_R0603  [R0603]
R30  100  R-EU_R0603  [R0603]
R31  100  R-EU_R0603  [R0603]
R32  100  R-EU_R0603  [R0603]
RD  MAX4820EUP+  [MAX4820EUP+]
TP_I2C_NINT  RSPRO-1MM-TERMINAL-POST-2622034  [RSPRO-1MM-TERMINAL-POST-2622034]
TP_I2C_SCL  RSPRO-1MM-TERMINAL-POST-2622034  [RSPRO-1MM-TERMINAL-POST-2622034]
TP_I2C_SDA  RSPRO-1MM-TERMINAL-POST-2622034  [RSPRO-1MM-TERMINAL-POST-2622034]
TP_RD_NRESET  RSPRO-1MM-TERMINAL-POST-2622034  [RSPRO-1MM-TERMINAL-POST-2622034]
TP_SPI_CONFIG_RD_NCS  RSPRO-1MM-TERMINAL-POST-2622034  [RSPRO-1MM-TERMINAL-POST-2622034]

### Nets
+3V3: C9.1 C65.1 C66.1 IC11.16(VCC) RD.1(VCC) RD.2(!SET) RD.15(COM) ; also sheet 3,4
+5V: R27.2 R28.2 R29.2 R30.2 R31.2 R32.2 ; also sheet 2,3
ADC_NRESET: IC11.4(P0) ; also sheet 4
GND: C9.2 C65.2 C66.2 IC11.1(A0) IC11.2(A1) IC11.3(A2) IC11.8(GND) RD.9(GND) RD.12(PGND) RD.18(PGND) RD.21(GND) ; also sheet 2,3,4
I2C_NINT: IC11.13(!INT) TP_I2C_NINT.P$1 ; also sheet 2
I2C_SCL: IC11.14(SCL) TP_I2C_SCL.P$1 ; also sheet 2
I2C_SDA: IC11.15(SDA) TP_I2C_SDA.P$1 ; also sheet 2
RD_NRESET: IC11.7(P3) RD.3(!RESET) TP_RD_NRESET.P$1
RD_OUT1: R27.1 RD.20(OUT1) ; also sheet 5
RD_OUT2: R28.1 RD.19(OUT2) ; also sheet 5
RD_OUT3: R29.1 RD.17(OUT3) ; also sheet 5
RD_OUT4: R30.1 RD.16(OUT4) ; also sheet 5
RD_OUT5: R31.1 RD.14(OUT5) ; also sheet 5
RD_OUT6: R32.1 RD.13(OUT6) ; also sheet 5
SPI_CONFIG_ADC_NCS: IC11.5(P1) ; also sheet 4
SPI_CONFIG_CLK: RD.6(SCLK) ; also sheet 2,4
SPI_CONFIG_MISO: RD.7(DOUT) ; also sheet 2,4
SPI_CONFIG_MOSI: RD.5(DIN) ; also sheet 2,4
SPI_CONFIG_RD_NCS: IC11.6(P2) RD.4(!CS) TP_SPI_CONFIG_RD_NCS.P$1
Unconnected: IC11.9(P4) IC11.10(P5) IC11.11(P6) IC11.12(P7) RD.10(OUT8) RD.11(OUT7)

### Notes on the sheet
- n.c.
- I2C SLAVE ADDRESS:
  0b0111000
- n.c.
- n.c.
- n.c.
- n.c.
- n.c.
- RELAY CONTROL
- pd, 2022
- pd

## Library data of the parts
ADC = AD7768-4BSTZ:AD7768-4BSTZ
C1 C2 = rcl:CPOL-EU: POLARIZED CAPACITOR, European symbol; SPICEPREFIX: C
C4-C8 = RCL:CPOL-EU: POLARIZED CAPACITOR, European symbol; SPICEPREFIX: C
C9-C32 C36-C44 C53-C56 C65 C66 = RCL:C-EU: CAPACITOR, European symbol; SPICEPREFIX: C
CON_BACKPLANE = 09031326921:09031326921
CON_EXT_CH1+ CON_EXT_CH1- CON_EXT_CH2+ CON_EXT_CH2- = DELOCK_65848:DELOCK_65848
CON_INT_CH1+ CON_INT_CH1- CON_INT_CH2+ CON_INT_CH2- = 2337019-1:2337019-1
IC1 = LM1117:LM1117IMPX-*
IC2 = LM1117:LM1117MPX-*
IC3 = ADR445ARZ:ADR445ARZ
IC5 IC6 = ADA4945-1ACPZ-R7:ADA4945-1ACPZ-R7
IC11 = TCA9534ADWR:TCA9534ADWR
L1 = VLS6045AF-101M:VLS6045AF-101M
LED_+3.3V LED_+5V_ANALOG = led:LED: LED OSRAM: - CHIPLED LG R971, LG N971, LY N971, LG Q971, LY Q971, LO R971, LY R971 LH N974, LH R974 LS Q976, LO Q976, LY Q976 LO Q996 - Hyper CHIPLED LW Q18S LB Q993, LB Q99A, LB R99A - SideLED LS A670, LO A670, LY A670, LG A670, LP A670 LB A673, LV A673, LT A673, LW A673 LH A674 LY A675 LS A676, LA A676, LO A676, LY A676, LW A676 LS A679, LY A679, LG A679 - Hyper Micro SIDELED® LS Y876, LA Y876, LO Y876, LY Y876 LT Y87S - SmartLED LW L88C, LW L88S LB L89C, LB L89S, LG L890 LS L89K, LO L89K, LY L89K LS L896, LA L896, LO L896, LY L896 - TOPLED LS T670, LO T670, LY T670, LG T670, LP T670 LSG T670, LSP T670, LSY T670, LOP T670, LYG T670 LG T671, LOG T671, LSG T671 LB T673, LV T673, LT T673, LW T673 LH T674 LS T676, LA T676, LO T676, LY T676, LB T676, LH T676, LSB T676, LW T676 LB T67C, LV T67C, LT T67C, LS T67K, LO T67K, LY T67K, LW E67C LS E67B, LA E67B, LO E67B, LY E67B, LB E67C, LV E67C, LT E67C LW T67C LS T679, LY T679, LG T679 LS T770, LO T770, LY T770, LG T770, LP T770 LB T773, LV T773, LT T773, LW T773 LH T774 LS E675, LA E675, LY E675, LS T675 LS T776, LA T776, LO T776, LY T776, LB T776 LHGB T686 LT T68C, LB T68C - Hyper Mini TOPLED® LB M676 - Mini TOPLED Santana® LG M470 LS M47K, LO M47K, LY M47K Source: http://www.osram.convergy.de LUXEON: - LUMILED® LXK2-PW12-R00, LXK2-PW12-S00, LXK2-PW14-U00, LXK2-PW14-V00 LXK2-PM12-R00, LXK2-PM12-S00, LXK2-PM14-U00 LXK2-PE12-Q00, LXK2-PE12-R00, LXK2-PE12-S00, LXK2-PE14-T00, LXK2-PE14-U00 LXK2-PB12-K00, LXK2-PB12-L00, LXK2-PB12-M00, LXK2-PB14-N00, LXK2-PB14-P00, LXK2-PB14-Q00 LXK2-PR12-L00, LXK2-PR12-M00, LXK2-PR14-Q00, LXK2-PR14-R00 LXK2-PD12-Q00, LXK2-PD12-R00, LXK2-PD12-S00 LXK2-PH12-R00, LXK2-PH12-S00 LXK2-PL12-P00, LXK2-PL12-Q00, LXK2-PL12-R00 Source: www.luxeon.com KINGBRIGHT: KA-3528ASYC Source: www.kingbright.com
OSC1 = SG-210STF-32.7680ML3:SG-210STF-32.7680ML3
PCB_BRACKET = 60807-011:60807-011
R1-R7 R10-R22 R27-R32 = RCL:R-EU_: RESISTOR, European symbol; SPICEPREFIX: R
RD = MAX4820EUP+:MAX4820EUP+
RELAY1-RELAY3 = 5-1462037-8:5-1462037-8
SJ1 = JUMPER:SJ2W: SMD solder JUMPER
TP_ADC_NRESET TP_AGND1 TP_AGND2 TP_FDA1_IN_N TP_FDA1_IN_P TP_FDA1_OUT_N TP_FDA1_OUT_P TP_FDA2_IN_N TP_FDA2_IN_P TP_FDA2_OUT_N TP_FDA2_OUT_P TP_GND1 TP_GND2 TP_I2C_NINT TP_I2C_SCL TP_I2C_SDA TP_RD_NRESET TP_SHIELD1 TP_SPI_CONFIG_ADC_NCS TP_SPI_CONFIG_CLK TP_SPI_CONFIG_MISO TP_SPI_CONFIG_MOSI TP_SPI_CONFIG_RD_NCS TP_SPI_DATA_CLK TP_SPI_DATA_MOSI TP_SPI_DATA_NCS TP_VCM TP_VCM_ADC TP_VREF_5V = RSPRO-1MM-TERMINAL-POST-2622034:RSPRO-1MM-TERMINAL-POST-2622034